# Altium schematic sheet 2CAN_readme.SchDoc
size A; SheetNumber: 1; SheetTotal: 4
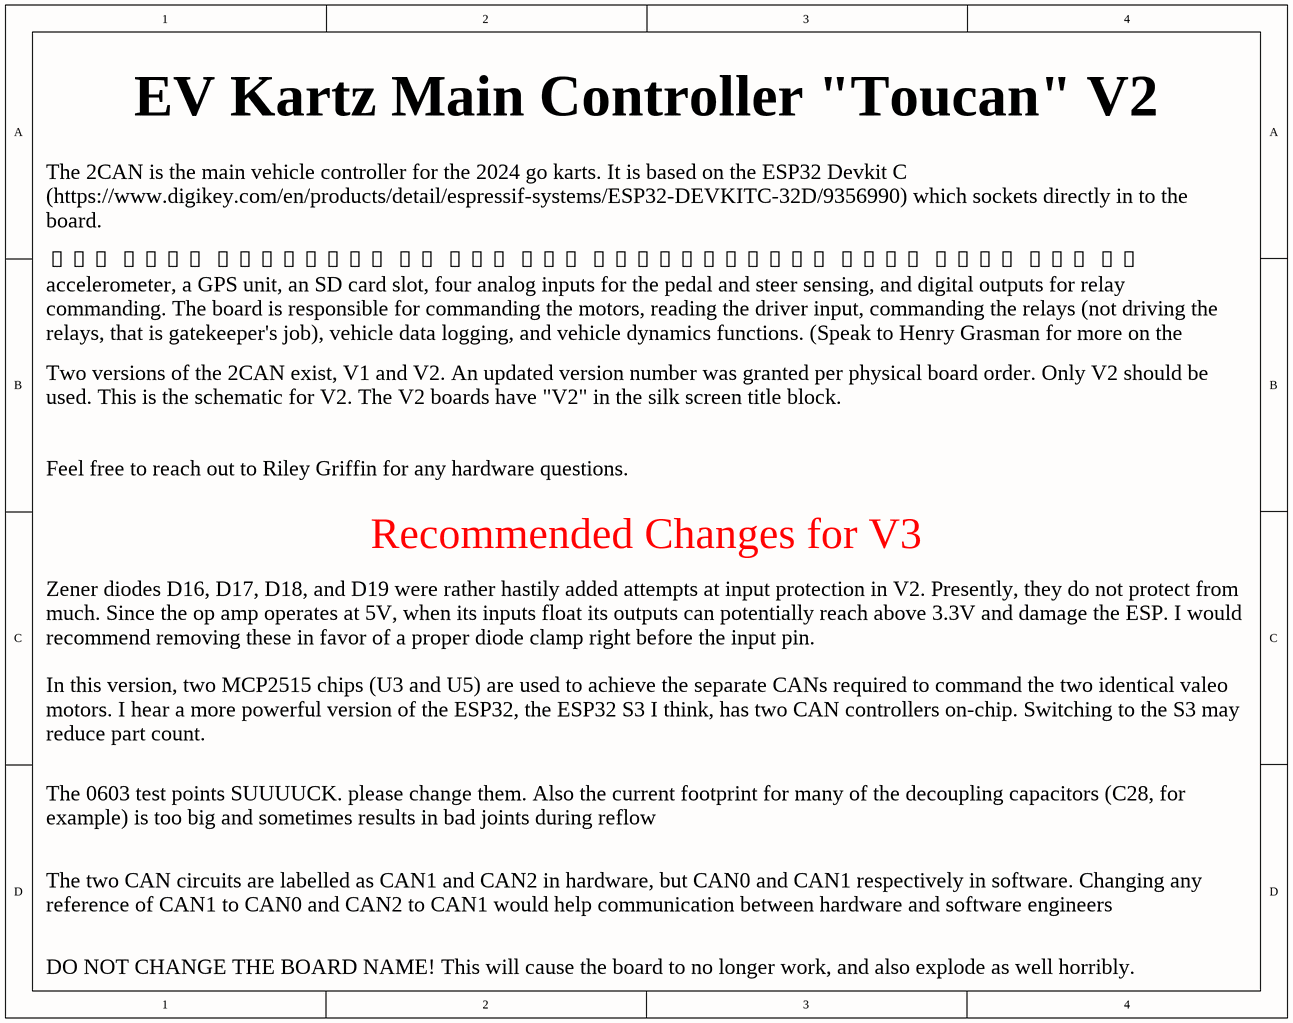
[diagram p0: 2CAN_readme.SchDoc]

## Notes on the sheet
- EV Kartz Main Controller "Toucan" V2
- The 2CAN is the main vehicle controller for the 2024 go karts. It is based on the ESP32 Devkit C (https://www.digikey.com/en/products/detail/espressif-systems/ESP32-DEVKITC-32D/9356990) which sockets directly in to the board.
- The 2CAN consists of two CAN controllers (get it?? 😳), an accelerometer, a GPS unit, an SD card slot, four analog inputs for the pedal and steer sensing, and digital outputs for relay commanding. The board is responsible for commanding the motors, reading the driver input, commanding the relays (not driving the relays, that is gatekeeper's job), vehicle data logging, and vehicle dynamics functions. (Speak to Henry Grasman for more on the software.)
- Two versions of the 2CAN exist, V1 and V2. An updated version number was granted per physical board order. Only V2 should be used. This is the schematic for V2. The V2 boards have "V2" in the silk screen title block.
- Feel free to reach out to Riley Griffin for any hardware questions.
- Recommended Changes for V3
- Zener diodes D16, D17, D18, and D19 were rather hastily added attempts at input protection in V2. Presently, they do not protect from much. Since the op amp operates at 5V, when its inputs float its outputs can potentially reach above 3.3V and damage the ESP. I would recommend removing these in favor of a proper diode clamp right before the input pin.
- In this version, two MCP2515 chips (U3 and U5) are used to achieve the separate CANs required to command the two identical valeo motors. I hear a more powerful version of the ESP32, the ESP32 S3 I think, has two CAN controllers on-chip. Switching to the S3 may reduce part count.
- The 0603 test points SUUUUCK. please change them. Also the current footprint for many of the decoupling capacitors (C28, for example) is too big and sometimes results in bad joints during reflow
- The two CAN circuits are labelled as CAN1 and CAN2 in hardware, but CAN0 and CAN1 respectively in software. Changing any reference of CAN1 to CAN0 and CAN2 to CAN1 would help communication between hardware and software engineers
- DO NOT CHANGE THE BOARD NAME! This will cause the board to no longer work, and also explode as well horribly.